# Altium schematic sheet eMMC FLASH INTERFACE.SchDoc
size A3; DocumentNumber: 5; SheetNumber: 6; SheetTotal: 14
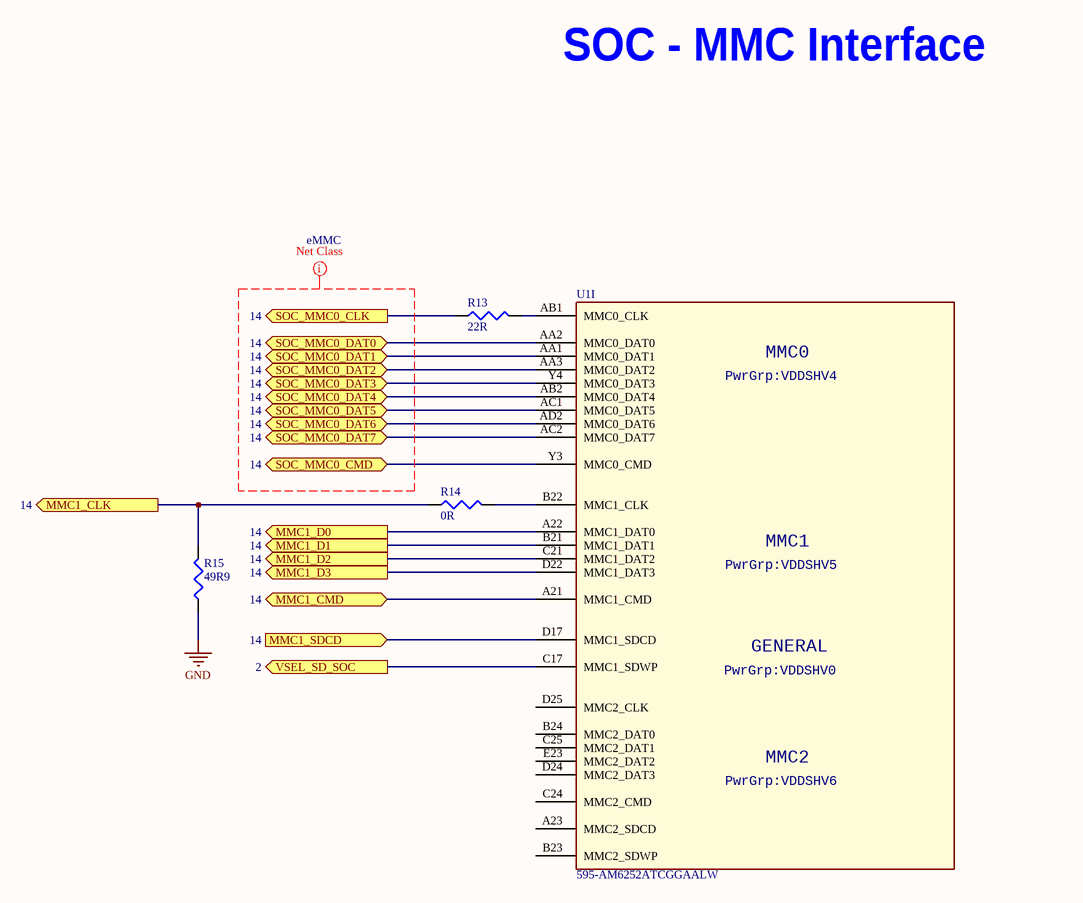
[diagram p0: eMMC FLASH INTERFACE.SchDoc]

## Parts
R13  22R  [R0402]
R14  0R  [R0402]
R15  49R9  [R0402]
U1  Supplier Part Number 1: 595-AM6252ATCGGAALW  [BGA425C50P25X25_1300X1300X89]  (hidden comment: AM62-EVM_BGA425)  (part I of 18)

## Ports
MMC1_CLK (out, see 14), MMC1_CMD (bidir, see 14), MMC1_D0 (out, see 14), MMC1_D1 (out, see 14), MMC1_D2 (out, see 14), MMC1_D3 (out, see 14), MMC1_SDCD (in, see 14), SOC_MMC0_CLK (out, see 14), SOC_MMC0_CMD (bidir, see 14), SOC_MMC0_DAT0 (bidir, see 14), SOC_MMC0_DAT1 (bidir, see 14), SOC_MMC0_DAT2 (bidir, see 14), SOC_MMC0_DAT3 (bidir, see 14), SOC_MMC0_DAT4 (bidir, see 14), SOC_MMC0_DAT5 (bidir, see 14), SOC_MMC0_DAT6 (bidir, see 14), SOC_MMC0_DAT7 (bidir, see 14), VSEL_SD_SOC (out, see 2)

## Nets
GND: R15.1
MMC1_CLK: R14.1 R15.2 ; port MMC1_CLK
MMC1_CMD: U1.A21(MMC1_CMD) ; port MMC1_CMD
MMC1_D0: U1.A22(MMC1_DAT0) ; port MMC1_D0
MMC1_D1: U1.B21(MMC1_DAT1) ; port MMC1_D1
MMC1_D2: U1.C21(MMC1_DAT2) ; port MMC1_D2
MMC1_D3: U1.D22(MMC1_DAT3) ; port MMC1_D3
MMC1_SDCD: U1.D17(MMC1_SDCD) ; port MMC1_SDCD
SOC_MMC0_CLK: R13.1 ; port SOC_MMC0_CLK
SOC_MMC0_CMD: U1.Y3(MMC0_CMD) ; port SOC_MMC0_CMD
SOC_MMC0_DAT0: U1.AA2(MMC0_DAT0) ; port SOC_MMC0_DAT0
SOC_MMC0_DAT1: U1.AA1(MMC0_DAT1) ; port SOC_MMC0_DAT1
SOC_MMC0_DAT2: U1.AA3(MMC0_DAT2) ; port SOC_MMC0_DAT2
SOC_MMC0_DAT3: U1.Y4(MMC0_DAT3) ; port SOC_MMC0_DAT3
SOC_MMC0_DAT4: U1.AB2(MMC0_DAT4) ; port SOC_MMC0_DAT4
SOC_MMC0_DAT5: U1.AC1(MMC0_DAT5) ; port SOC_MMC0_DAT5
SOC_MMC0_DAT6: U1.AD2(MMC0_DAT6) ; port SOC_MMC0_DAT6
SOC_MMC0_DAT7: U1.AC2(MMC0_DAT7) ; port SOC_MMC0_DAT7
VSEL_SD_SOC: U1.C17(MMC1_SDWP) ; port VSEL_SD_SOC
NetR13_2: R13.2 U1.AB1(MMC0_CLK)
NetR14_2: R14.2 U1.B22(MMC1_CLK)

Not connected (* = marked no-connect by the designer): U1 A23(MMC2_SDCD) B23(MMC2_SDWP) B24(MMC2_DAT0) C24(MMC2_CMD) C25(MMC2_DAT1) D24(MMC2_DAT3) D25(MMC2_CLK) E23(MMC2_DAT2)

## Layout directives
net class eMMC: (no net found under the mark)

## Notes on the sheet
- SOC - MMC Interface
- (in symbol AM62-EVM_BGA425, part I) MMC0; PwrGrp:VDDSHV4; MMC1; PwrGrp:VDDSHV5; GENERAL; PwrGrp:VDDSHV0; MMC2; PwrGrp:VDDSHV6

## Library data of the parts
R13 = RC0402FR-0722RL: RES 22.0 OHM 1/16W 1% 0402 SMD; Manufacturer: Yageo; Resistance (Ohms): 22; Power (Watts): 0.063W, 1/16W; .Checked PCB: used; Temperature Coefficient: ±100ppm/°C; Category: Resistors; Supplier Part Number: 311-22.0LRCT-ND; Manufacturer Part Number: RC0402FR-0722RL; Package / Case: 0402 (1005 Metric); Price 1k [$]: 0.01421; Tolerance: ±1%; Value: 22R; .Checked SCH: used; Supplier: Digikey; Supplier 1: Digi-Key; Supplier Part Number 1: 311-22.0LRCT-ND; RoHS: RoHS Compliant; Stock 1: 943800; Pricing 1: 10=0.014, 50=0.0104, 100=0.0079, 250=0.00584, 500=0.00432, 1000=0.00288 (USD); Composition: Thick Film; Features: -; Size / Dimension: 0.039" L x 0.020" W (1.00mm x 0.50mm); Height: 0.016" (0.40mm); Number of Terminations: 2; Packaging: Cut Tape (CT); ComponentLink1URL: http://www.yageo.com/documents/recent/PYu-RC0402_51_RoHS_L_6.pdf; ComponentLink1Description: http://www.yageo.com/documents/recent/PYu-RC0402_51_RoHS_L_6.pdf
R14 = RC0402JR-070RL: RES 0.0 OHM 1/16W 0402 SMD; Manufacturer: Yageo; Resistance (Ohms): 0.0; Power (Watts): 0.063W, 1/16W; Tolerance: Jumper; .Checked PCB: used; Category: Resistors; Supplier Part Number: 311-0.0JRCT-ND; Manufacturer Part Number: RC0402JR-070RL; Package / Case: 0402 (1005 Metric); Price 1k [$]: 0.01389; Value: 0R; .Checked SCH: used; Supplier: Digikey; Supplier 1: Digi-Key; Supplier Part Number 1: 311-0.0JRCT-ND; RoHS: RoHS Compliant; Stock 1: 1106330; Pricing 1: 10=0.012, 50=0.009, 100=0.0069, 250=0.00512, 500=0.0038, 1000=0.00253 (USD); Composition: Thick Film; Features: -; Temperature Coefficient: -; Size / Dimension: 0.039" L x 0.020" W (1.00mm x 0.50mm); Height: 0.016" (0.40mm); Number of Terminations: 2; Packaging: Cut Tape (CT); ComponentLink1URL: http://www.yageo.com/documents/recent/PYu-RC0402_51_RoHS_L_6.pdf; ComponentLink1Description: http://www.yageo.com/documents/recent/PYu-RC0402_51_RoHS_L_6.pdf
R15 = RC0402FR-0749R9L: RES 49.9 OHM 1/16W 1% 0402 SMD; Manufacturer: Yageo; Resistance (Ohms): 49.9; Power (Watts): 0.063W, 1/16W; Value: 49.9R; .Checked PCB: used; Temperature Coefficient: ±100ppm/°C; Category: Resistors; Supplier Part Number: 311-49.9LRCT-ND; Manufacturer Part Number: RC0402FR-0749R9L; Package / Case: 0402 (1005 Metric); Price 1k [$]: 0.01421; Tolerance: ±1%; .Checked SCH: used; Supplier: Digikey; Supplier 1: Digi-Key; Supplier Part Number 1: 311-49.9LRCT-ND; RoHS: RoHS Compliant; Stock 1: 235950; Pricing 1: 10=0.014, 50=0.0104, 100=0.0079, 250=0.00584, 500=0.00432, 1000=0.00288 (USD); Composition: Thick Film; Features: -; Size / Dimension: 0.039" L x 0.020" W (1.00mm x 0.50mm); Height: 0.016" (0.40mm); Number of Terminations: 2; Packaging: Cut Tape (CT); ComponentLink1URL: http://www.yageo.com/documents/recent/PYu-RC0402_51_RoHS_L_6.pdf; ComponentLink1Description: http://www.yageo.com/documents/recent/PYu-RC0402_51_RoHS_L_6.pdf
U1 = AM62-EVM_BGA425: ARM® Cortex®-A53 Microprocessor IC Sitara™ 2 Core, 64-Bit 1.4GHz 425-FCCSP (13x13); Manufacturer: Texas Instruments; Manufacturer Part Number: AM6252ATCGGAALW; Supplier 1: Mouser; Stock 1: 0; Pricing 1: 1=21.23, 10=19.58, 50=18.7, 100=18.7, 1000=15.94, 10000=15.94 (USD)